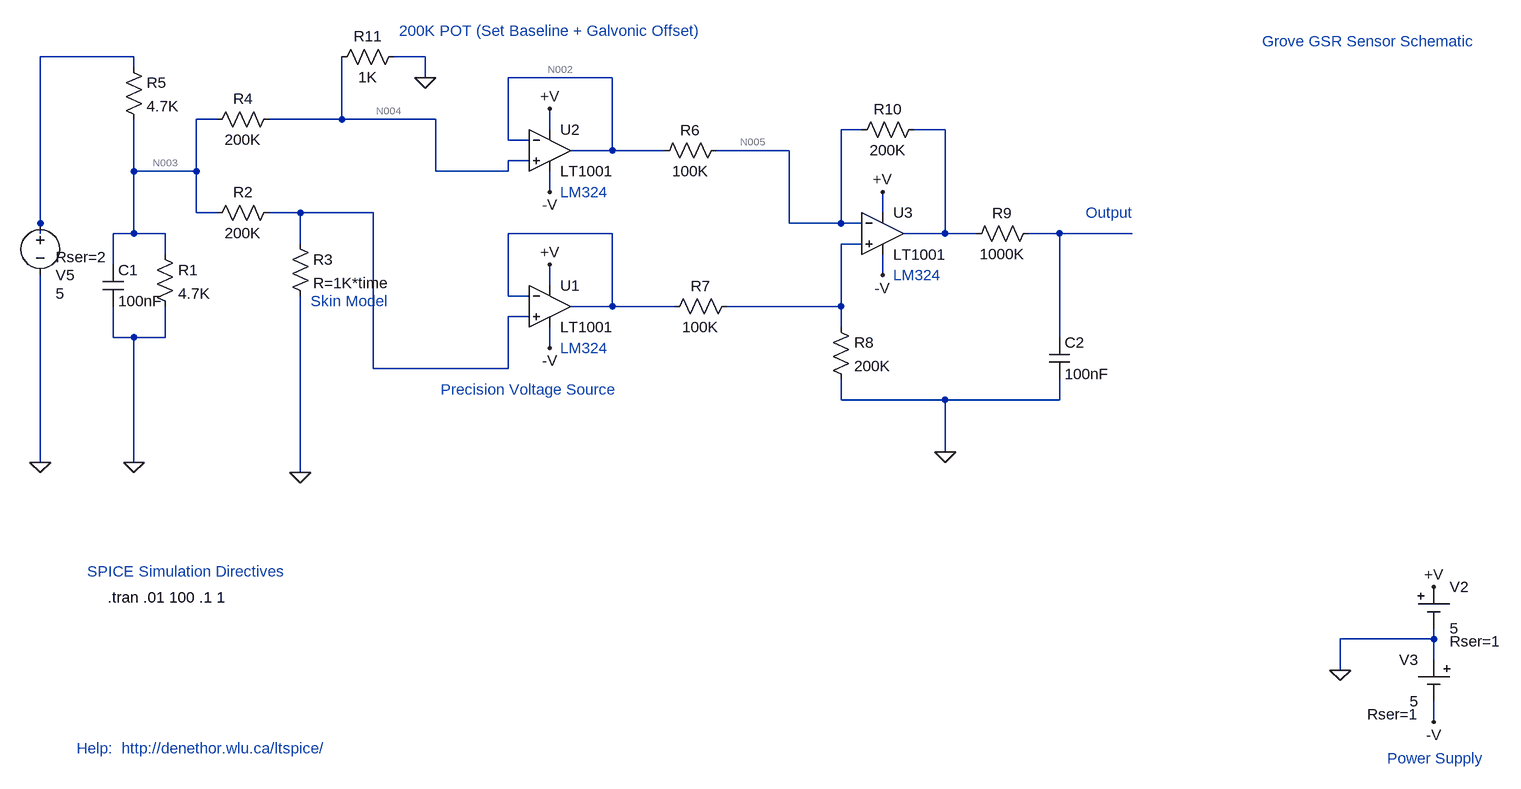
[diagram p0: schematic GSR5.asc]
GSR5.asc, the LTspice schematic file:
Version 4
SHEET 1 1356 1016
WIRE -1264 -208 -1408 -208
WIRE -816 -208 -864 -208
WIRE -1264 -192 -1264 -208
WIRE -816 -176 -816 -208
WIRE -528 -176 -688 -176
WIRE -1136 -112 -1168 -112
WIRE -944 -112 -944 -208
WIRE -944 -112 -1056 -112
WIRE -800 -112 -944 -112
WIRE -624 -96 -624 -128
WIRE -144 -96 -176 -96
WIRE -16 -96 -64 -96
WIRE -688 -80 -688 -176
WIRE -656 -80 -688 -80
WIRE -528 -64 -528 -176
WIRE -528 -64 -592 -64
WIRE -448 -64 -528 -64
WIRE -256 -64 -368 -64
WIRE -656 -48 -688 -48
WIRE -1264 -32 -1264 -112
WIRE -1168 -32 -1168 -112
WIRE -1168 -32 -1264 -32
WIRE -800 -32 -800 -112
WIRE -688 -32 -688 -48
WIRE -688 -32 -800 -32
WIRE -624 0 -624 -32
WIRE -1168 32 -1168 -32
WIRE -1136 32 -1168 32
WIRE -1008 32 -1056 32
WIRE -896 32 -1008 32
WIRE -112 32 -112 0
WIRE -1408 48 -1408 -208
WIRE -256 48 -256 -64
WIRE -176 48 -176 -96
WIRE -176 48 -256 48
WIRE -144 48 -176 48
WIRE -1408 64 -1408 48
WIRE -1264 64 -1264 -32
WIRE -1264 64 -1296 64
WIRE -1216 64 -1264 64
WIRE -528 64 -688 64
WIRE -16 64 -16 -96
WIRE -16 64 -80 64
WIRE 32 64 -16 64
WIRE 160 64 112 64
WIRE 272 64 160 64
WIRE -1008 80 -1008 32
WIRE -144 80 -176 80
WIRE -1216 96 -1216 64
WIRE -1296 112 -1296 64
WIRE -112 128 -112 96
WIRE -624 144 -624 112
WIRE -688 160 -688 64
WIRE -656 160 -688 160
WIRE -528 176 -528 64
WIRE -528 176 -592 176
WIRE -432 176 -528 176
WIRE -176 176 -176 80
WIRE -176 176 -352 176
WIRE -656 192 -688 192
WIRE -176 208 -176 176
WIRE -1296 224 -1296 176
WIRE -1264 224 -1296 224
WIRE -1216 224 -1216 176
WIRE -1216 224 -1264 224
WIRE 160 224 160 64
WIRE -624 240 -624 208
WIRE -896 272 -896 32
WIRE -688 272 -688 192
WIRE -688 272 -896 272
WIRE -176 320 -176 288
WIRE -16 320 -176 320
WIRE 160 320 160 288
WIRE 160 320 -16 320
WIRE -16 400 -16 320
WIRE -1408 416 -1408 128
WIRE -1264 416 -1264 224
WIRE -1008 432 -1008 160
WIRE 736 688 736 672
WIRE 736 688 592 688
WIRE 736 720 736 688
WIRE 592 736 592 688
WIRE 736 816 736 784
FLAG 736 608 +V
FLAG 736 816 -V
FLAG 592 736 0
FLAG -624 0 -V
FLAG -624 -128 +V
FLAG -1408 416 0
FLAG -1008 432 0
FLAG -1264 416 0
FLAG -624 240 -V
FLAG -624 112 +V
FLAG -112 128 -V
FLAG -112 0 +V
FLAG -16 400 0
FLAG -816 -176 0
SYMBOL Opamps\\LT1001 -624 -128 R0
SYMATTR InstName U2
SYMBOL Misc\\cell 736 608 R0
WINDOW 123 0 0 Left 2
WINDOW 39 24 84 Left 2
SYMATTR SpiceLine Rser=1
SYMATTR InstName V2
SYMATTR Value 5
SYMBOL Misc\\cell 736 720 M0
WINDOW 123 0 0 Left 2
WINDOW 39 24 84 Left 2
SYMATTR SpiceLine Rser=1
SYMATTR InstName V3
SYMATTR Value 5
SYMBOL voltage -1408 32 R0
WINDOW 0 24 96 Left 2
WINDOW 3 24 124 Left 2
WINDOW 39 24 68 Left 2
WINDOW 123 0 0 Left 2
SYMATTR InstName V5
SYMATTR Value 5
SYMATTR SpiceLine Rser=2
SYMBOL res -1024 64 R0
SYMATTR InstName R3
SYMATTR Value R=1K*time
SYMBOL res -1280 -208 R0
SYMATTR InstName R5
SYMATTR Value 4.7K
SYMBOL res -1232 80 R0
SYMATTR InstName R1
SYMATTR Value 4.7K
SYMBOL cap -1312 112 R0
SYMATTR InstName C1
SYMATTR Value 100nF
SYMBOL res -1040 16 R90
WINDOW 0 0 56 VBottom 2
WINDOW 3 32 56 VTop 2
SYMATTR InstName R2
SYMATTR Value 200K
SYMBOL res -1040 -128 R90
WINDOW 0 0 56 VBottom 2
WINDOW 3 32 56 VTop 2
SYMATTR InstName R4
SYMATTR Value 200K
SYMBOL Opamps\\LT1001 -624 112 R0
SYMATTR InstName U1
SYMBOL res -352 -80 R90
WINDOW 0 0 56 VBottom 2
WINDOW 3 32 56 VTop 2
SYMATTR InstName R6
SYMATTR Value 100K
SYMBOL res -336 160 R90
WINDOW 0 0 56 VBottom 2
WINDOW 3 32 56 VTop 2
SYMATTR InstName R7
SYMATTR Value 100K
SYMBOL Opamps\\LT1001 -112 0 R0
SYMATTR InstName U3
SYMBOL res -192 192 R0
SYMATTR InstName R8
SYMATTR Value 200K
SYMBOL cap 144 224 R0
SYMATTR InstName C2
SYMATTR Value 100nF
SYMBOL res 128 48 R90
WINDOW 0 0 56 VBottom 2
WINDOW 3 32 56 VTop 2
SYMATTR InstName R9
SYMATTR Value 1000K
SYMBOL res -48 -112 R90
WINDOW 0 0 56 VBottom 2
WINDOW 3 32 56 VTop 2
SYMATTR InstName R10
SYMATTR Value 200K
SYMBOL res -848 -224 R90
WINDOW 0 0 56 VBottom 2
WINDOW 3 32 56 VTop 2
SYMATTR InstName R11
SYMATTR Value 1K
TEXT -1352 856 Left 2 ;Help:  http://denethor.wlu.ca/ltspice/
TEXT -1336 584 Left 2 ;SPICE Simulation Directives
TEXT -1304 624 Left 2 !.tran .01 100 .1 1
TEXT -608 0 Left 2 ;LM324
TEXT 664 872 Left 2 ;Power Supply
TEXT -792 304 Left 2 ;Precision Voltage Source
TEXT -608 240 Left 2 ;LM324
TEXT -96 128 Left 2 ;LM324
TEXT 200 32 Left 2 ;Output
TEXT -992 168 Left 2 ;Skin Model
TEXT -856 -248 Left 2 ;200K POT (Set Baseline + Galvonic Offset)
TEXT 472 -232 Left 2 ;Grove GSR Sensor Schematic

The netlist it stands for:
* GSR5.asc
XU2 N004 N002 +V -V N002 LT1001  ; pins In+ In- V+ V- OUT
V2 +V 0 5 Rser=1
V3 0 -V 5 Rser=1
V5 N001 0 5 Rser=2
R3 N007 0 R=1K*time
R5 N001 N003 4.7K
R1 N003 0 4.7K
C1 N003 0 100nF
R2 N007 N003 200K
R4 N004 N003 200K
XU1 N007 N008 +V -V N008 LT1001  ; pins In+ In- V+ V- OUT
R6 N005 N002 100K
R7 N010 N008 100K
XU3 N010 N005 +V -V N006 LT1001  ; pins In+ In- V+ V- OUT
R8 N010 0 200K
C2 N009 0 100nF
R9 N009 N006 1000K
R10 N006 N005 200K
R11 0 N004 1K
* Help:  http://denethor.wlu.ca/ltspice/
* SPICE Simulation Directives
.tran .01 100 .1 1
* LM324
* Power Supply
* Precision Voltage Source
* LM324
* LM324
* Output
* Skin Model
* 200K POT (Set Baseline + Galvonic Offset)
* Grove GSR Sensor Schematic
.lib LTC.lib
.backanno
.end

* Results of the author's LTspice run, read from the files saved beside the schematic
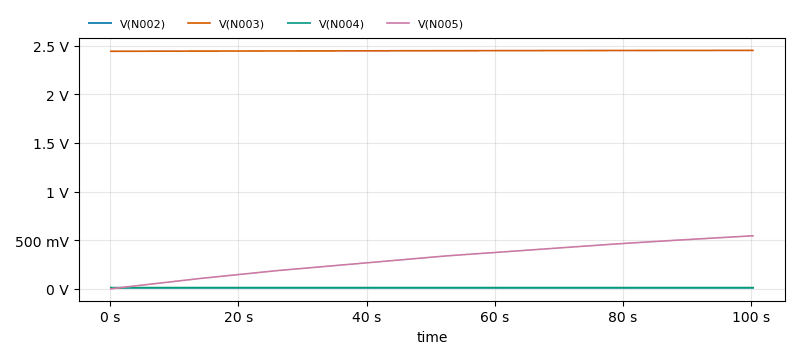
[diagram p1: Transient Analysis of GSR5.asc, plotted from the saved traces]
* Transient Analysis, 1 run:
*   V(N002): min 12.15 mV, max 12.2 mV, average 12.18 mV, rms 12.18 mV, last 12.2 mV
*   V(N003): min 2.442 V, max 2.452 V, average 2.448 V, rms 2.448 V, last 2.452 V
*   V(N004): min 12.15 mV, max 12.2 mV, average 12.18 mV, rms 12.18 mV, last 12.2 mV
*   V(N005): min 971 µV, max 545.7 mV, average 308.1 mV, rms 348.2 mV, last 545.7 mV